# EAGLE schematic RectangularThing-SOICs-TWEAKS-2 (EAGLE 7.7.0)

## Sheet 1 of 7: Power & Modulation Routing
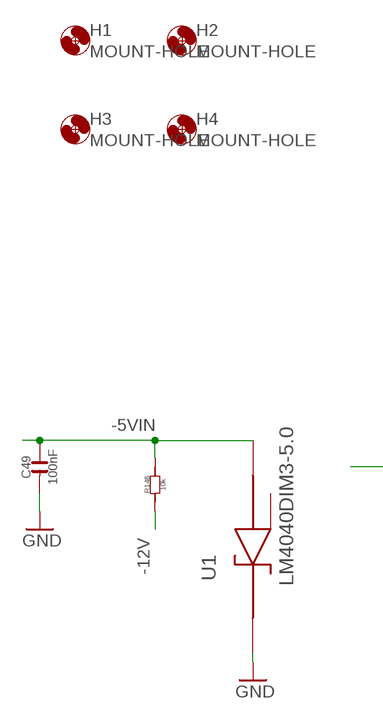
[diagram p0: schematic, sheet 1, part 1 of 2]
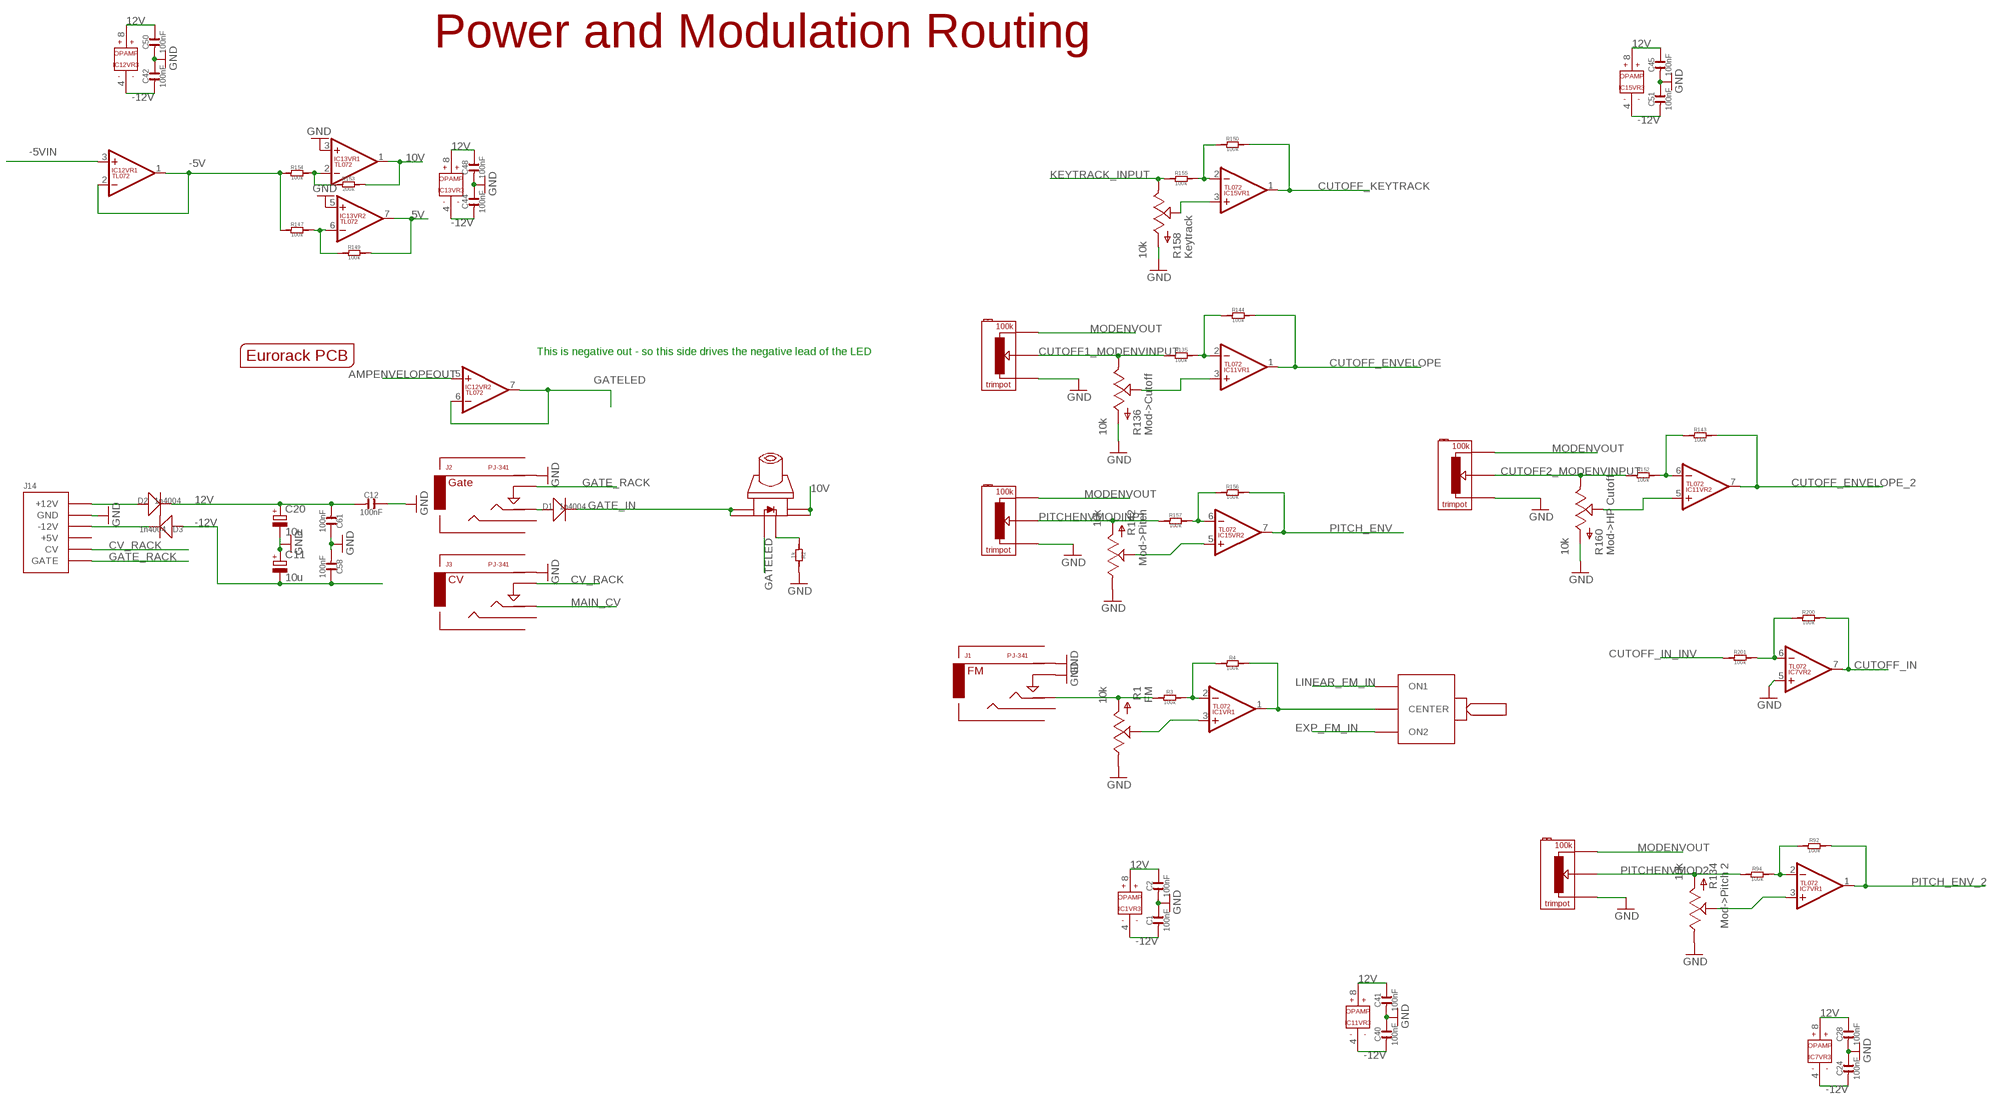
[diagram p1: schematic, sheet 1, part 2 of 2]

### Parts
C1  100nF  C-0603  [C0603]
C2  100nF  C-0603  [C0603]
C11  10u  CAPACITOR_POL-CASE_B  [CASE_B]
C12  100nF  C-0603  [C0603]
C20  10u  CAPACITOR_POL-CASE_B  [CASE_B]
C24  100nF  C-0603  [C0603]
C28  100nF  C-0603  [C0603]
C40  100nF  C-0603  [C0603]
C41  100nF  C-0603  [C0603]
C42  100nF  C-0603  [C0603]
C44  100nF  C-0603  [C0603]
C45  100nF  C-0603  [C0603]
C48  100nF  C-0603  [C0603]
C49  100nF  C-0603  [C0603]
C50  100nF  C-0603  [C0603]
C51  100nF  C-0603  [C0603]
C58  100nF  C-0603  [C0603]
C61  100nF  C-0603  [C0603]
D1  1n4004  D-SMA  [DO-214AC]
D2  1n4004  D-SMA  [DO-214AC]
D3  1n4004  D-SMA  [DO-214AC]
H1  MOUNT-HOLE  [3.2-NOMARKINGS-SMALLSAFEZONE]
H2  MOUNT-HOLE  [3.2-NOMARKINGS-SMALLSAFEZONE]
H3  MOUNT-HOLE  [3.2-NOMARKINGS-SMALLSAFEZONE]
H4  MOUNT-HOLE  [3.2-NOMARKINGS-SMALLSAFEZONE]
IC1  TL072  [SO08]
IC7  TL072  [SO08]
IC11  TL072  [SO08]
IC12  TL072  [SO08]
IC13  TL072  [SO08]
IC15  TL072  [SO08]
J1  PJ-341  AUDIO-JACKINPUT  [3.5MM-JACK-SWITCH-13MM-INPUT]
J2  PJ-341  AUDIO-JACKINPUT  [3.5MM-JACK-SWITCH-13MM-INPUT]
J3  PJ-341  AUDIO-JACKINPUT  [3.5MM-JACK-SWITCH-13MM-INPUT]
J14  POWERSHROUDED  [POWER_16_SHROUDED]
PCB1  EURORACK_PCB36HP_10CM  [EURORACK36HP]
R1  10k  POTZEPHPOT  [OG-POTS_ALPS_POT_VERTICAL]
R2  1k  R-0603  [R0603]
R3  100k  R-0603  [R0603]
R4  100k  R-0603  [R0603]
R92  100k  R-0603  [R0603]
R94  100k  R-0603  [R0603]
R134  10k  POTZEPHPOT  [OG-POTS_ALPS_POT_VERTICAL]
R135  100k  R-0603  [R0603]
R136  10k  POTZEPHPOT  [OG-POTS_ALPS_POT_VERTICAL]
R142  10k  POTZEPHPOT  [OG-POTS_ALPS_POT_VERTICAL]
R143  100k  R-0603  [R0603]
R144  100k  R-0603  [R0603]
R147  100k  R-0603  [R0603]
R148  10k  R-0603  [R0603]
R149  100k  R-0603  [R0603]
R150  100k  R-0603  [R0603]
R152  100k  R-0603  [R0603]
R153  200k  R-0603  [R0603]
R154  100k  R-0603  [R0603]
R155  100k  R-0603  [R0603]
R156  100k  R-0603  [R0603]
R157  100k  R-0603  [R0603]
R158  10k  POTZEPHPOT  [OG-POTS_ALPS_POT_VERTICAL]
R160  10k  POTZEPHPOT  [OG-POTS_ALPS_POT_VERTICAL]
R191  100k  TRIMPOT  [TRIMPOT]
R192  100k  TRIMPOT  [TRIMPOT]
R193  100k  TRIMPOT  [TRIMPOT]
R194  100k  TRIMPOT  [TRIMPOT]
R200  100k  R-0603  [R0603]
R201  100k  R-0603  [R0603]
S1  ONOFFON  [MULTICOMP1MS-ONOFFON]
S2  SWITCH_W_LED_PB6149L-X-102YELLOW  [PB6149L]
U1  LM4040DIM3-5.0  [SOT95P237X112-3N]

### Nets
5V [power]: IC13.7(VR2:OUT) R149.2 ; also sheet 2,5,6
10V [power]: IC13.1(VR1:OUT) R153.2 S2.3 S2.4 ; also sheet 2,6
12V [power]: C2.2 C12.1 C20.+ C28.2 C41.2 C45.2 C48.2 C50.2 C61.1 D2.2(-) IC1.8(VR3:V+) IC7.8(VR3:V+) IC11.8(VR3:V+) IC12.8(VR3:V+) IC13.8(VR3:V+) IC15.8(VR3:V+) ; also sheet 2,4,5,6,7
-5_TO_10V: IC13.2(VR1:-IN) R153.1 R154.2
-5V [power]: IC12.1(VR1:OUT) IC12.2(VR1:-IN) R147.1 R154.1 ; also sheet 2,5,6
-5V_TO_5V: IC13.6(VR2:-IN) R147.2 R149.1
-5VIN [power]: C49.2 IC12.3(VR1:+IN) R148.2 U1.2(ANODE)
-12V [power]: C1.1 C11.- C24.1 C40.1 C42.1 C44.1 C51.1 C58.2 D3.1(+) IC1.4(VR3:V-) IC7.4(VR3:V-) IC11.4(VR3:V-) IC12.4(VR3:V-) IC13.4(VR3:V-) IC15.4(VR3:V-) R148.1 ; also sheet 2,4,5,6,7
AMPENVELOPEOUT: IC12.5(VR2:+IN) ; also sheet 4,5
CUTOFF1_MODENVINPUT: R135.1 R136.P$1(E) R192.P$2
CUTOFF2_MODENVINPUT: R152.1 R160.P$1(E) R194.P$2
CUTOFF_ENVELOPE: IC11.1(VR1:OUT) R144.2 ; also sheet 6
CUTOFF_ENVELOPE_2: IC11.7(VR2:OUT) R143.2 ; also sheet 6
CUTOFF_IN: IC7.7(VR2:OUT) R200.2 ; also sheet 6
CUTOFF_IN_INV: R201.1 ; also sheet 6
CUTOFF_KEYTRACK: IC15.1(VR1:OUT) R150.2 ; also sheet 6
CV_RACK: J3.SWITCH@3(SWITCH) J14.13(CV) J14.14(CV)
EXP_FM_IN: S1.3(ON2) ; also sheet 2
GATE_IN: D1.2(-) S2.1 S2.2 ; also sheet 5
GATE_RACK: J2.SWITCH@3(SWITCH) J14.15(GATE) J14.16(GATE)
GATELED: IC12.6(VR2:-IN) IC12.7(VR2:OUT) S2.LEDPOS(POS)
GND [power]: C1.2 C2.1 C11.+ C12.2 C20.- C24.2 C28.1 C40.2 C41.1 C42.2 C44.2 C45.1 C48.1 C49.1 C50.1 C51.2 C58.1 C61.2 IC7.5(VR2:+IN) IC13.3(VR1:+IN) IC13.5(VR2:+IN) J1.RING@3(RING) J1.SWITCH@3(SWITCH) J2.RING@3(RING) J3.RING@3(RING) J14.3(GND) J14.4(GND) J14.5(GND) J14.6(GND) J14.7(GND) J14.8(GND) R1.P$1(E) R2.2 R134.P$1(E) R136.P$3(A) R142.P$1(E) R158.P$3(A) R160.P$3(A) R191.P$1 R192.P$1 R193.P$1 R194.P$1 U1.1(CATHODE) ; also sheet 2,3,4,5,6,7
KEYTRACK_INPUT: R155.1 R158.P$1(E) ; also sheet 2
LINEAR_FM_IN: S1.1(ON1) ; also sheet 2
MAIN_CV: J3.TIP@3(TIP) ; also sheet 2
MODENVOUT: R191.P$3 R192.P$3 R193.P$3 R194.P$3 ; also sheet 5
N$7 [power]: D2.1(+) J14.9(+12V) J14.10(+12V)
N$8 [power]: D3.2(-) J14.1(-12V) J14.2(-12V)
N$22: R2.1 S2.LEDNEG(NEG)
N$41: IC1.1(VR1:OUT) R4.2 S1.2(CENTER)
N$66: IC1.2(VR1:-IN) R3.2 R4.1
N$67: IC15.2(VR1:-IN) R150.1 R155.2
N$68: IC15.3(VR1:+IN) R158.P$2(S)
N$69: IC11.2(VR1:-IN) R135.2 R144.1
N$72: IC15.6(VR2:-IN) R156.1 R157.2
N$73: IC11.3(VR1:+IN) R136.P$2(S)
N$75: IC7.2(VR1:-IN) R92.1 R94.2
N$76: IC7.3(VR1:+IN) R134.P$2(S)
N$78: IC15.5(VR2:+IN) R142.P$2(S)
N$81: IC1.3(VR1:+IN) R1.P$2(S)
N$82: J1.TIP@3(TIP) R1.P$3(A) R3.1
N$86: D1.1(+) J2.TIP@3(TIP)
N$126: IC11.6(VR2:-IN) R143.1 R152.2
N$127: IC11.5(VR2:+IN) R160.P$2(S)
N$148: IC7.6(VR2:-IN) R200.1 R201.2
PITCH_ENV: IC15.7(VR2:OUT) R156.2 ; also sheet 2
PITCH_ENV_2: IC7.1(VR1:OUT) R92.2 ; also sheet 2
PITCHENVMOD2: R94.1 R134.P$3(A) R191.P$2
PITCHENVMODINP1: R142.P$3(A) R157.1 R193.P$2
Unconnected: J1.SECOND@3(SECOND) J2.SECOND@3(SECOND) J3.SECOND@3(SECOND) J14.11(+5V) J14.12(+5V) U1.3(NC)

### Notes on the sheet
- Power and Modulation Routing
- This is negative out - so this side drives the negative lead of the LED

## Sheet 2 of 7: Oscillator
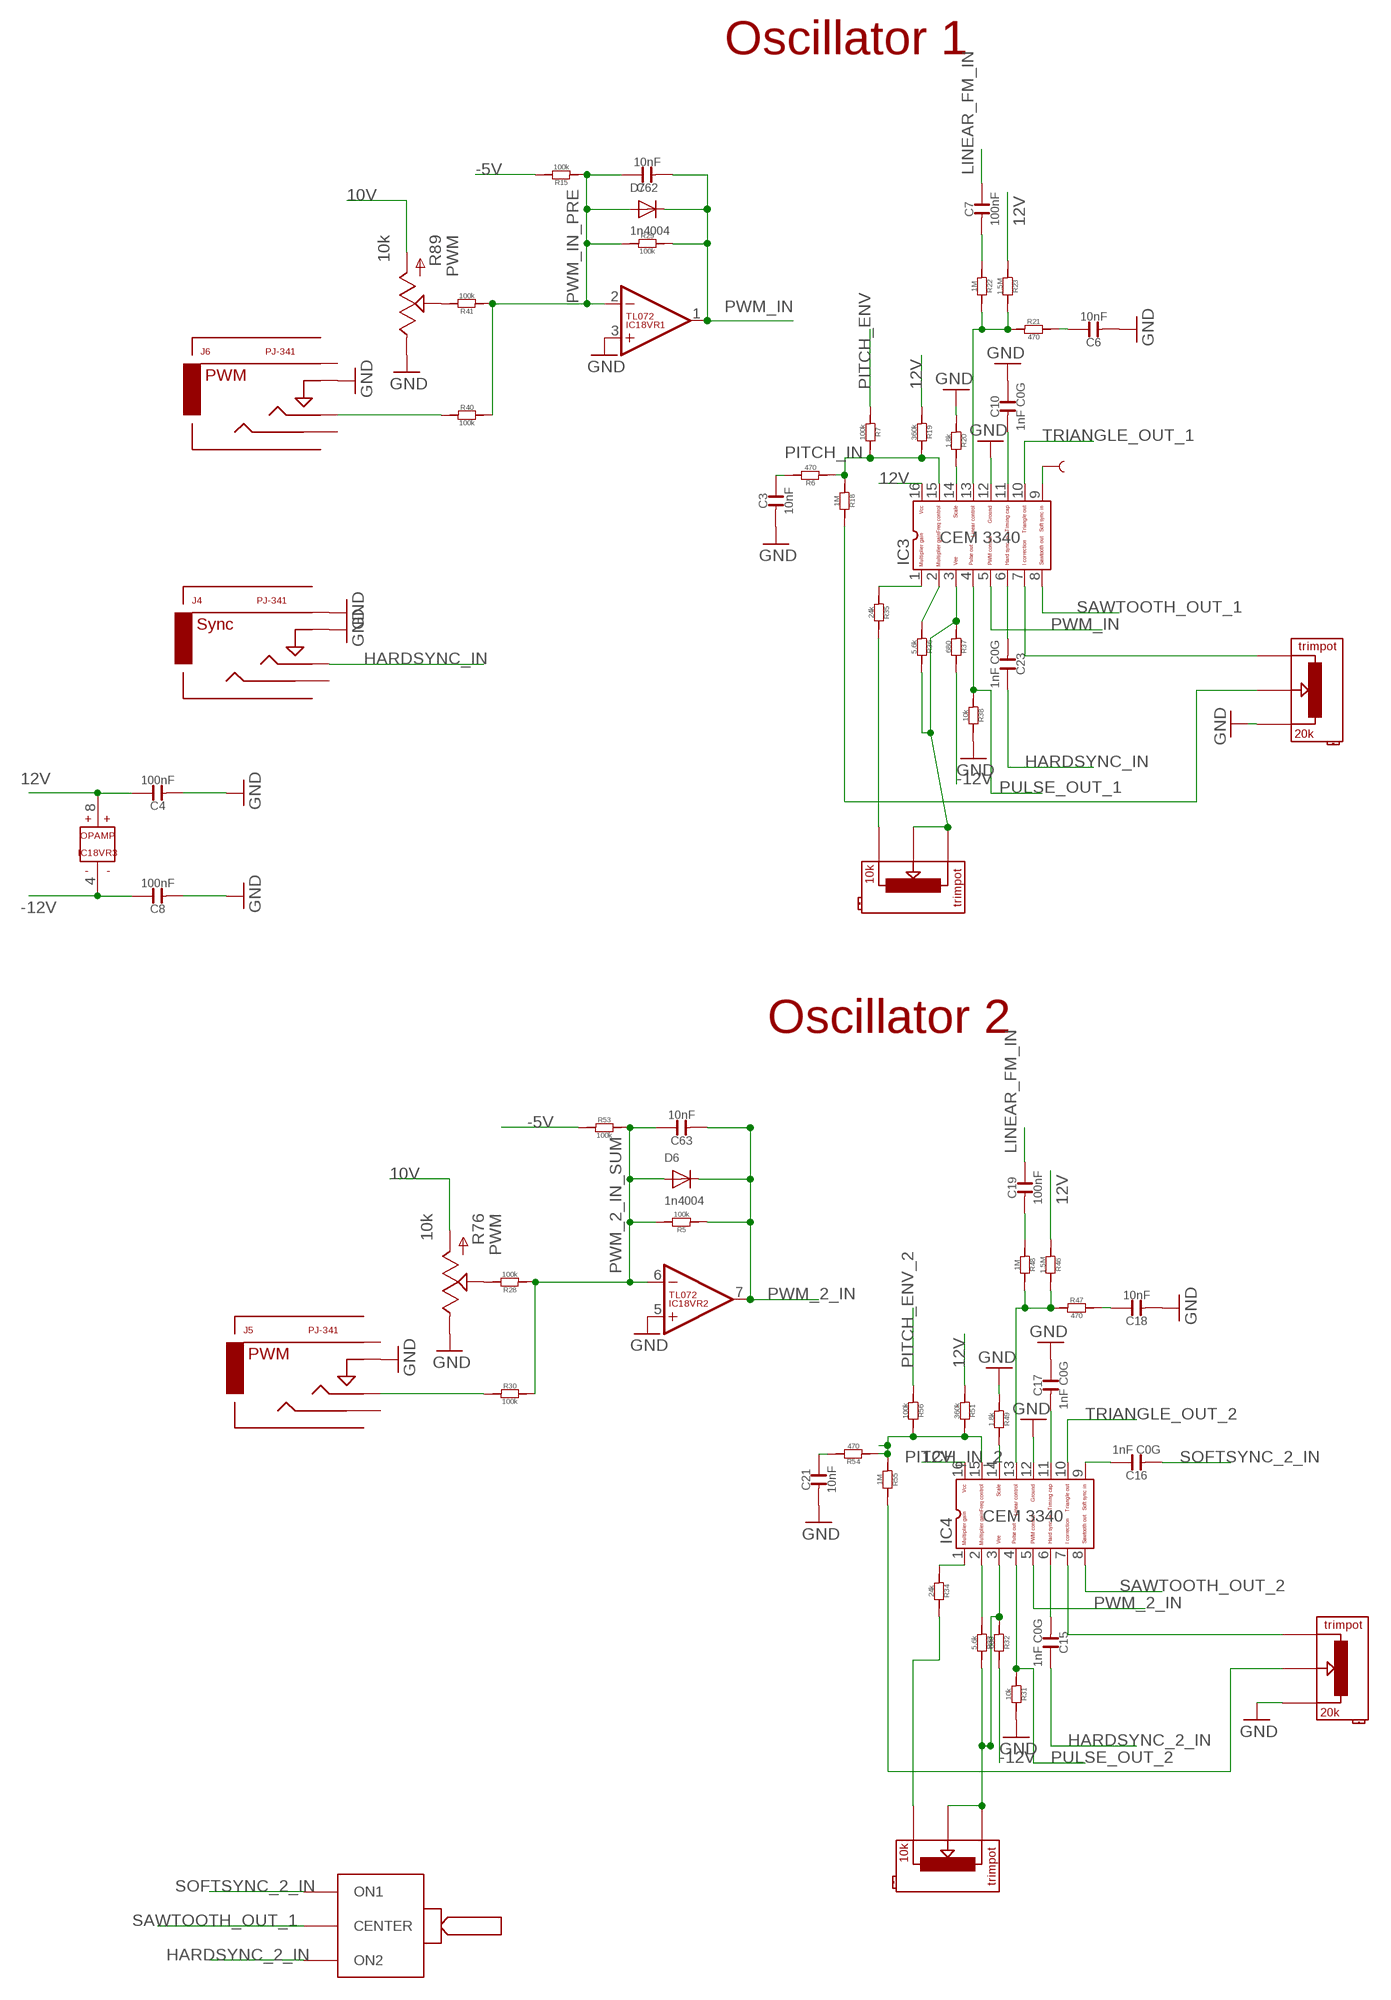
[diagram p2: schematic, sheet 2, part 1 of 2]
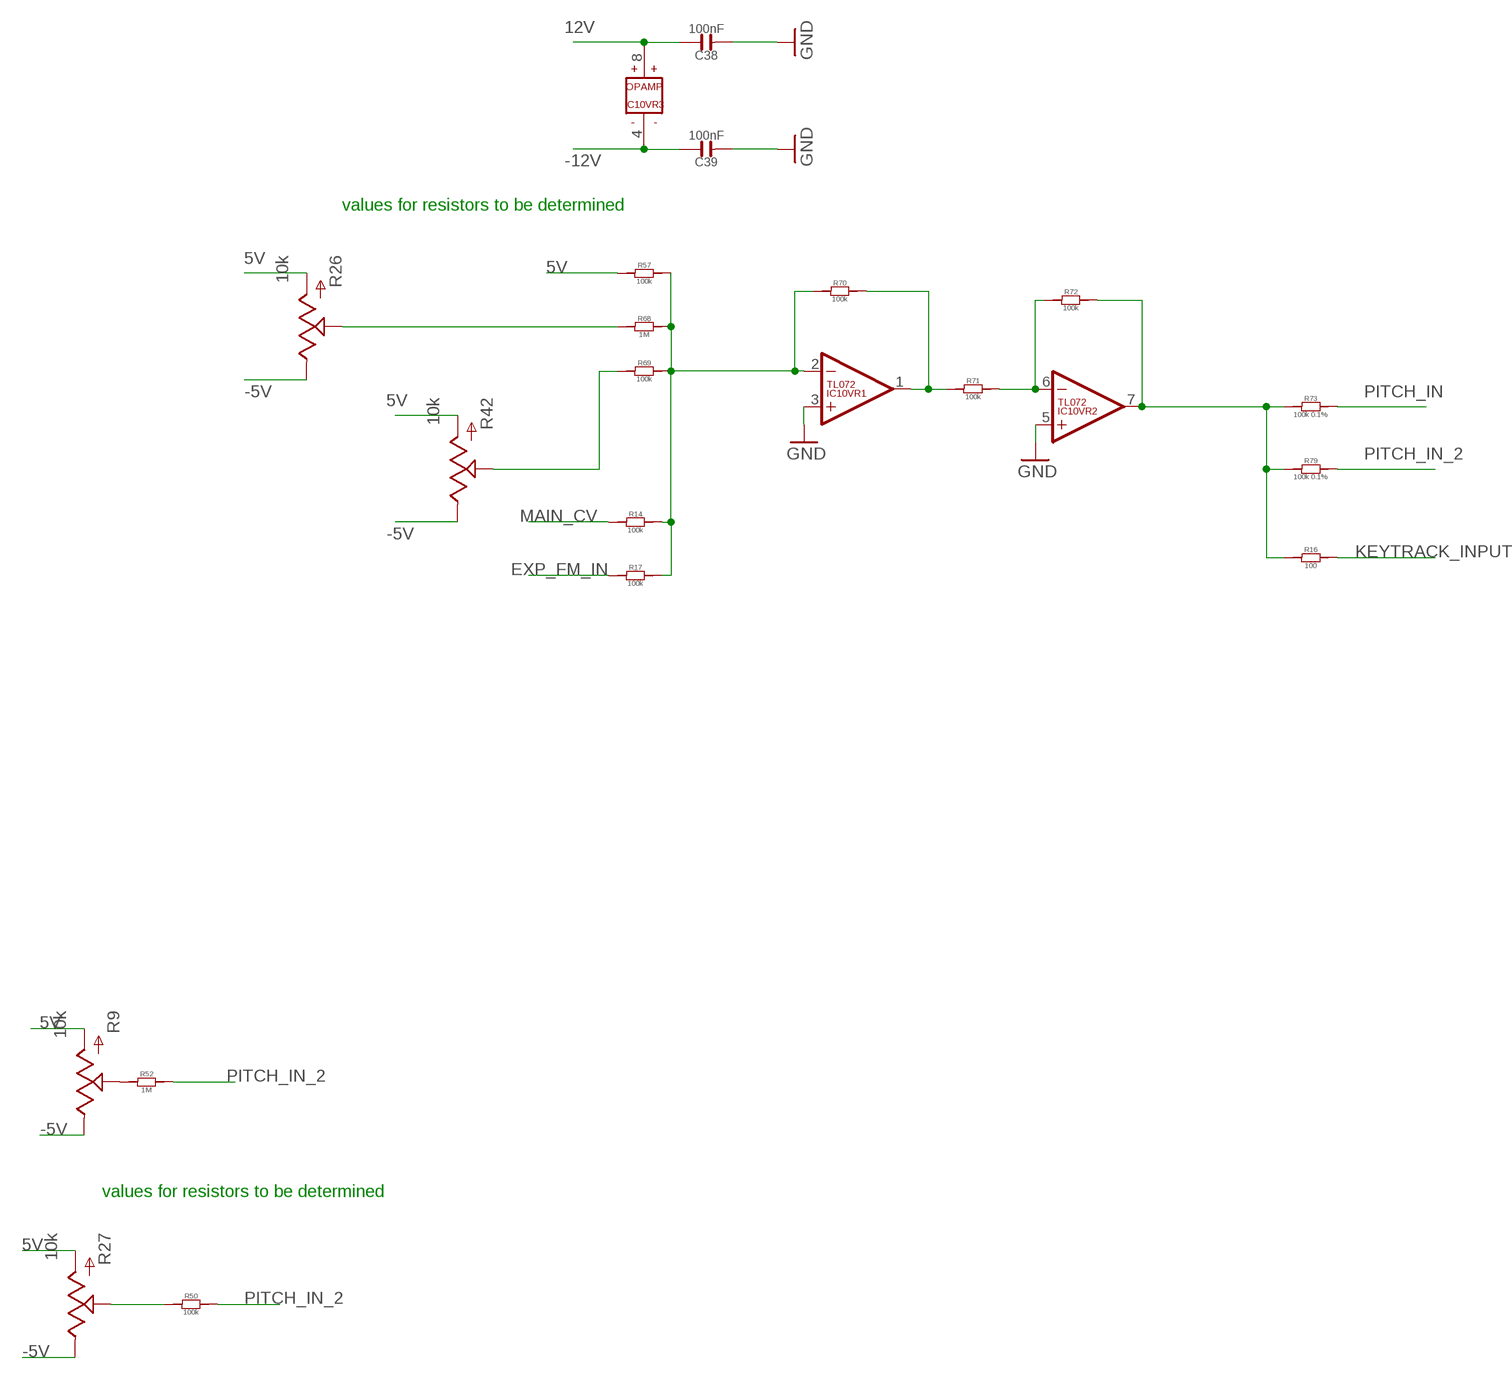
[diagram p3: schematic, sheet 2, part 2 of 2]

### Parts
C3  10nF  C-0603  [C0603]
C4  100nF  C-0603  [C0603]
C6  10nF  C-0603  [C0603]
C7  100nF  C-0603  [C0603]
C8  100nF  C-0603  [C0603]
C10  1nF C0G  C-0603  [C0603]
C15  1nF C0G  C-0603  [C0603]
C16  1nF C0G  C-0603  [C0603]
C17  1nF C0G  C-0603  [C0603]
C18  10nF  C-0603  [C0603]
C19  100nF  C-0603  [C0603]
C21  10nF  C-0603  [C0603]
C23  1nF C0G  C-0603  [C0603]
C38  100nF  C-0603  [C0603]
C39  100nF  C-0603  [C0603]
C62  10nF  C-0603  [C0603]
C63  10nF  C-0603  [C0603]
D6  1n4004  DIODESOD-323F  [SOD-323F]
D7  1n4004  DIODESOD-323F  [SOD-323F]
IC3  CEM3340SOIC16  [SO16]
IC4  CEM3340SOIC16  [SO16]
IC10  TL072  [SO08]
IC18  TL072  [SO08]
J4  PJ-341  AUDIO-JACKINPUT  [3.5MM-JACK-SWITCH-13MM-INPUT]
J5  PJ-341  AUDIO-JACKINPUT  [3.5MM-JACK-SWITCH-13MM-INPUT]
J6  PJ-341  AUDIO-JACKINPUT  [3.5MM-JACK-SWITCH-13MM-INPUT]
R5  100k  R-0603  [R0603]
R6  470  R-0603  [R0603]
R7  100k  R-0603  [R0603]
R9  10k  POTZEPHPOT_BIGKNOB  [OG-POTS_ALPS_POT_VERTICAL_WITHBIGKNOB]
R14  100k  R-0603  [R0603]
R15  100k  R-0603  [R0603]
R16  100  R-0603  [R0603]
R17  100k  R-0603  [R0603]
R18  1M  R-0603  [R0603]
R19  360k  R-0603  [R0603]
R20  1.8k  R-0603  [R0603]
R21  470  R-0603  [R0603]
R22  1M  R-0603  [R0603]
R23  1.5M  R-0603  [R0603]
R26  10k  POTZEPHPOT_BIGKNOB  [OG-POTS_ALPS_POT_VERTICAL_WITHBIGKNOB]
R27  10k  POTZEPHPOT_BIGKNOB  [OG-POTS_ALPS_POT_VERTICAL_WITHBIGKNOB]
R28  100k  R-0603  [R0603]
R29  100k  R-0603  [R0603]
R30  100k  R-0603  [R0603]
R31  10k  R-0603  [R0603]
R32  680  R-0603  [R0603]
R33  5.6k  R-0603  [R0603]
R34  24k  R-0603  [R0603]
R35  24k  R-0603  [R0603]
R36  5.6k  R-0603  [R0603]
R37  680  R-0603  [R0603]
R38  10k  R-0603  [R0603]
R40  100k  R-0603  [R0603]
R41  100k  R-0603  [R0603]
R42  10k  POTZEPHPOT_BIGKNOB  [OG-POTS_ALPS_POT_VERTICAL_WITHBIGKNOB]
R46  1.5M  R-0603  [R0603]
R47  470  R-0603  [R0603]
R48  1M  R-0603  [R0603]
R49  1.8k  R-0603  [R0603]
R50  100k  R-0603  [R0603]
R51  360k  R-0603  [R0603]
R52  1M  R-0603  [R0603]
R53  100k  R-0603  [R0603]
R54  470  R-0603  [R0603]
R55  1M  R-0603  [R0603]
R56  100k  R-0603  [R0603]
R57  100k  R-0603  [R0603]
R68  1M  R-0603  [R0603]
R69  100k  R-0603  [R0603]
R70  100k  R-0603  [R0603]
R71  100k  R-0603  [R0603]
R72  100k  R-0603  [R0603]
R73  100k 0.1%  R-0603  [R0603]
R76  10k  POTZEPHPOT  [OG-POTS_ALPS_POT_VERTICAL]
R79  100k 0.1%  R-0603  [R0603]
R89  10k  POTZEPHPOT  [OG-POTS_ALPS_POT_VERTICAL]
R187  10k  TRIMPOT  [TRIMPOT]
R188  20k  TRIMPOT  [TRIMPOT]
R189  20k  TRIMPOT  [TRIMPOT]
R190  10k  TRIMPOT  [TRIMPOT]
S3  ONOFFON  [MULTICOMP1MS-ONOFFON]
TP3  TEST-POINT3X5  [PAD.03X.05]

### Nets
5V [power]: R9.P$3(A) R26.P$3(A) R27.P$3(A) R42.P$3(A) R57.1 ; also sheet 1,5,6
10V [power]: R76.P$3(A) R89.P$3(A) ; also sheet 1,6
12V [power]: C4.2 C38.2 IC3.16 IC4.16 IC10.8(VR3:V+) IC18.8(VR3:V+) R19.1 R23.1 R46.1 R51.1 ; also sheet 1,4,5,6,7
-5V [power]: R9.P$1(E) R15.2 R26.P$1(E) R27.P$1(E) R42.P$1(E) R53.1 ; also sheet 1,5,6
-12V [power]: C8.2 C39.2 IC10.4(VR3:V-) IC18.4(VR3:V-) R32.2 R37.2 ; also sheet 1,4,5,6,7
EXP_FM_IN: R17.1 ; also sheet 1
GND [power]: C3.1 C4.1 C6.1 C8.1 C10.2 C17.2 C18.1 C21.1 C38.1 C39.1 IC3.12 IC4.12 IC10.3(VR1:+IN) IC10.5(VR2:+IN) IC18.3(VR1:+IN) IC18.5(VR2:+IN) J4.RING@3(RING) J4.SWITCH@3(SWITCH) J5.SWITCH@3(SWITCH) J6.SWITCH@3(SWITCH) R20.1 R31.2 R38.2 R49.1 R76.P$1(E) R89.P$1(E) R188.P$3 R189.P$3 ; also sheet 1,3,4,5,6,7
HARDSYNC_2_IN: C15.2 S3.3(ON2)
HARDSYNC_IN: C23.2 J4.TIP@3(TIP)
INVERTED_CVSUM: IC10.1(VR1:OUT) R70.2 R71.1
KEYTRACK_INPUT: R16.2 ; also sheet 1
LINEAR_FM_IN: C7.2 C19.2 ; also sheet 1
MAIN_CV: R14.1 ; also sheet 1
MAIN_CV_SUMLINE: IC10.2(VR1:-IN) R14.2 R17.2 R57.2 R68.2 R69.2 R70.1
MASTER_COARSEPITCH: R42.P$2(S) R69.1
MASTER_FINEPITCH: R26.P$2(S) R68.1
N$16: C3.2 R6.2
N$31: C6.2 R21.2
N$34: IC3.13 R21.1 R22.2 R23.2
N$35: C7.1 R22.1
N$36: C10.1 IC3.11
N$37: IC3.9 TP3.P$1
N$38: IC3.14 R20.2
N$42: C23.1 IC3.6
N$43: IC3.1 R35.1
N$44: R35.2 R190.P$3
N$45: IC3.3 R36.2 R37.1 R190.P$1 R190.P$2
N$46: R18.2 R188.P$2
N$47: IC3.2 R36.1
N$48: IC3.7 R188.P$1
N$71: C21.2 R54.2
N$77: C18.2 R47.2
N$83: R41.2 R89.P$2(S)
N$85: J6.TIP@3(TIP) R40.1
N$87: IC4.13 R46.2 R47.1 R48.2
N$88: C19.1 R48.1
N$89: C17.1 IC4.11
N$90: C16.2 IC4.9
N$92: IC4.14 R49.2
N$94: C15.1 IC4.6
N$95: IC4.1 R34.1
N$96: R34.2 R187.P$3
N$97: IC4.3 R32.1 R33.2 R187.P$1 R187.P$2
N$98: IC4.2 R33.1
N$99: R55.2 R189.P$2
N$100: IC4.7 R189.P$1
N$101: R28.2 R76.P$2(S)
N$103: J5.TIP@3(TIP) R30.1
N$104: R27.P$2(S) R50.1
N$105: R9.P$2(S) R52.1
PITCH_ENV: R7.1 ; also sheet 1
PITCH_ENV_2: R56.1 ; also sheet 1
PITCH_IN: IC3.15 R6.1 R7.2 R18.1 R19.2 R73.2
PITCH_IN_2: IC4.15 R50.2 R51.2 R52.2 R54.1 R55.1 R56.2 R79.2
POSTINVERTED_CVSUM: IC10.6(VR2:-IN) R71.2 R72.1
PRESUMMED_PITCH: IC10.7(VR2:OUT) R16.1 R72.2 R73.1 R79.1
PULSE_OUT_1: IC3.4 R38.1 ; also sheet 3
PULSE_OUT_2: IC4.4 R31.1 ; also sheet 3,7
PWM_2_IN: C63.1 D6.C IC4.5 IC18.7(VR2:OUT) R5.1
PWM_2_IN_SUM: C63.2 D6.A IC18.6(VR2:-IN) R5.2 R28.1 R30.2 R53.2
PWM_IN: C62.1 D7.C IC3.5 IC18.1(VR1:OUT) R29.2
PWM_IN_PRE: C62.2 D7.A IC18.2(VR1:-IN) R15.1 R29.1 R40.2 R41.1
SAWTOOTH_OUT_1: IC3.8 S3.2(CENTER) ; also sheet 3,7
SAWTOOTH_OUT_2: IC4.8 ; also sheet 3,7
SOFTSYNC_2_IN: C16.1 S3.1(ON1)
TRIANGLE_OUT_1: IC3.10 ; also sheet 3
TRIANGLE_OUT_2: IC4.10 ; also sheet 3
Unconnected: J4.SECOND@3(SECOND) J5.RING@3(RING) J5.SECOND@3(SECOND) J6.RING@3(RING) J6.SECOND@3(SECOND)

### Notes on the sheet
- Oscillator 1
- values for resistors to be determined
- Oscillator 2
- values for resistors to be determined

## Sheet 3 of 7: Mixer
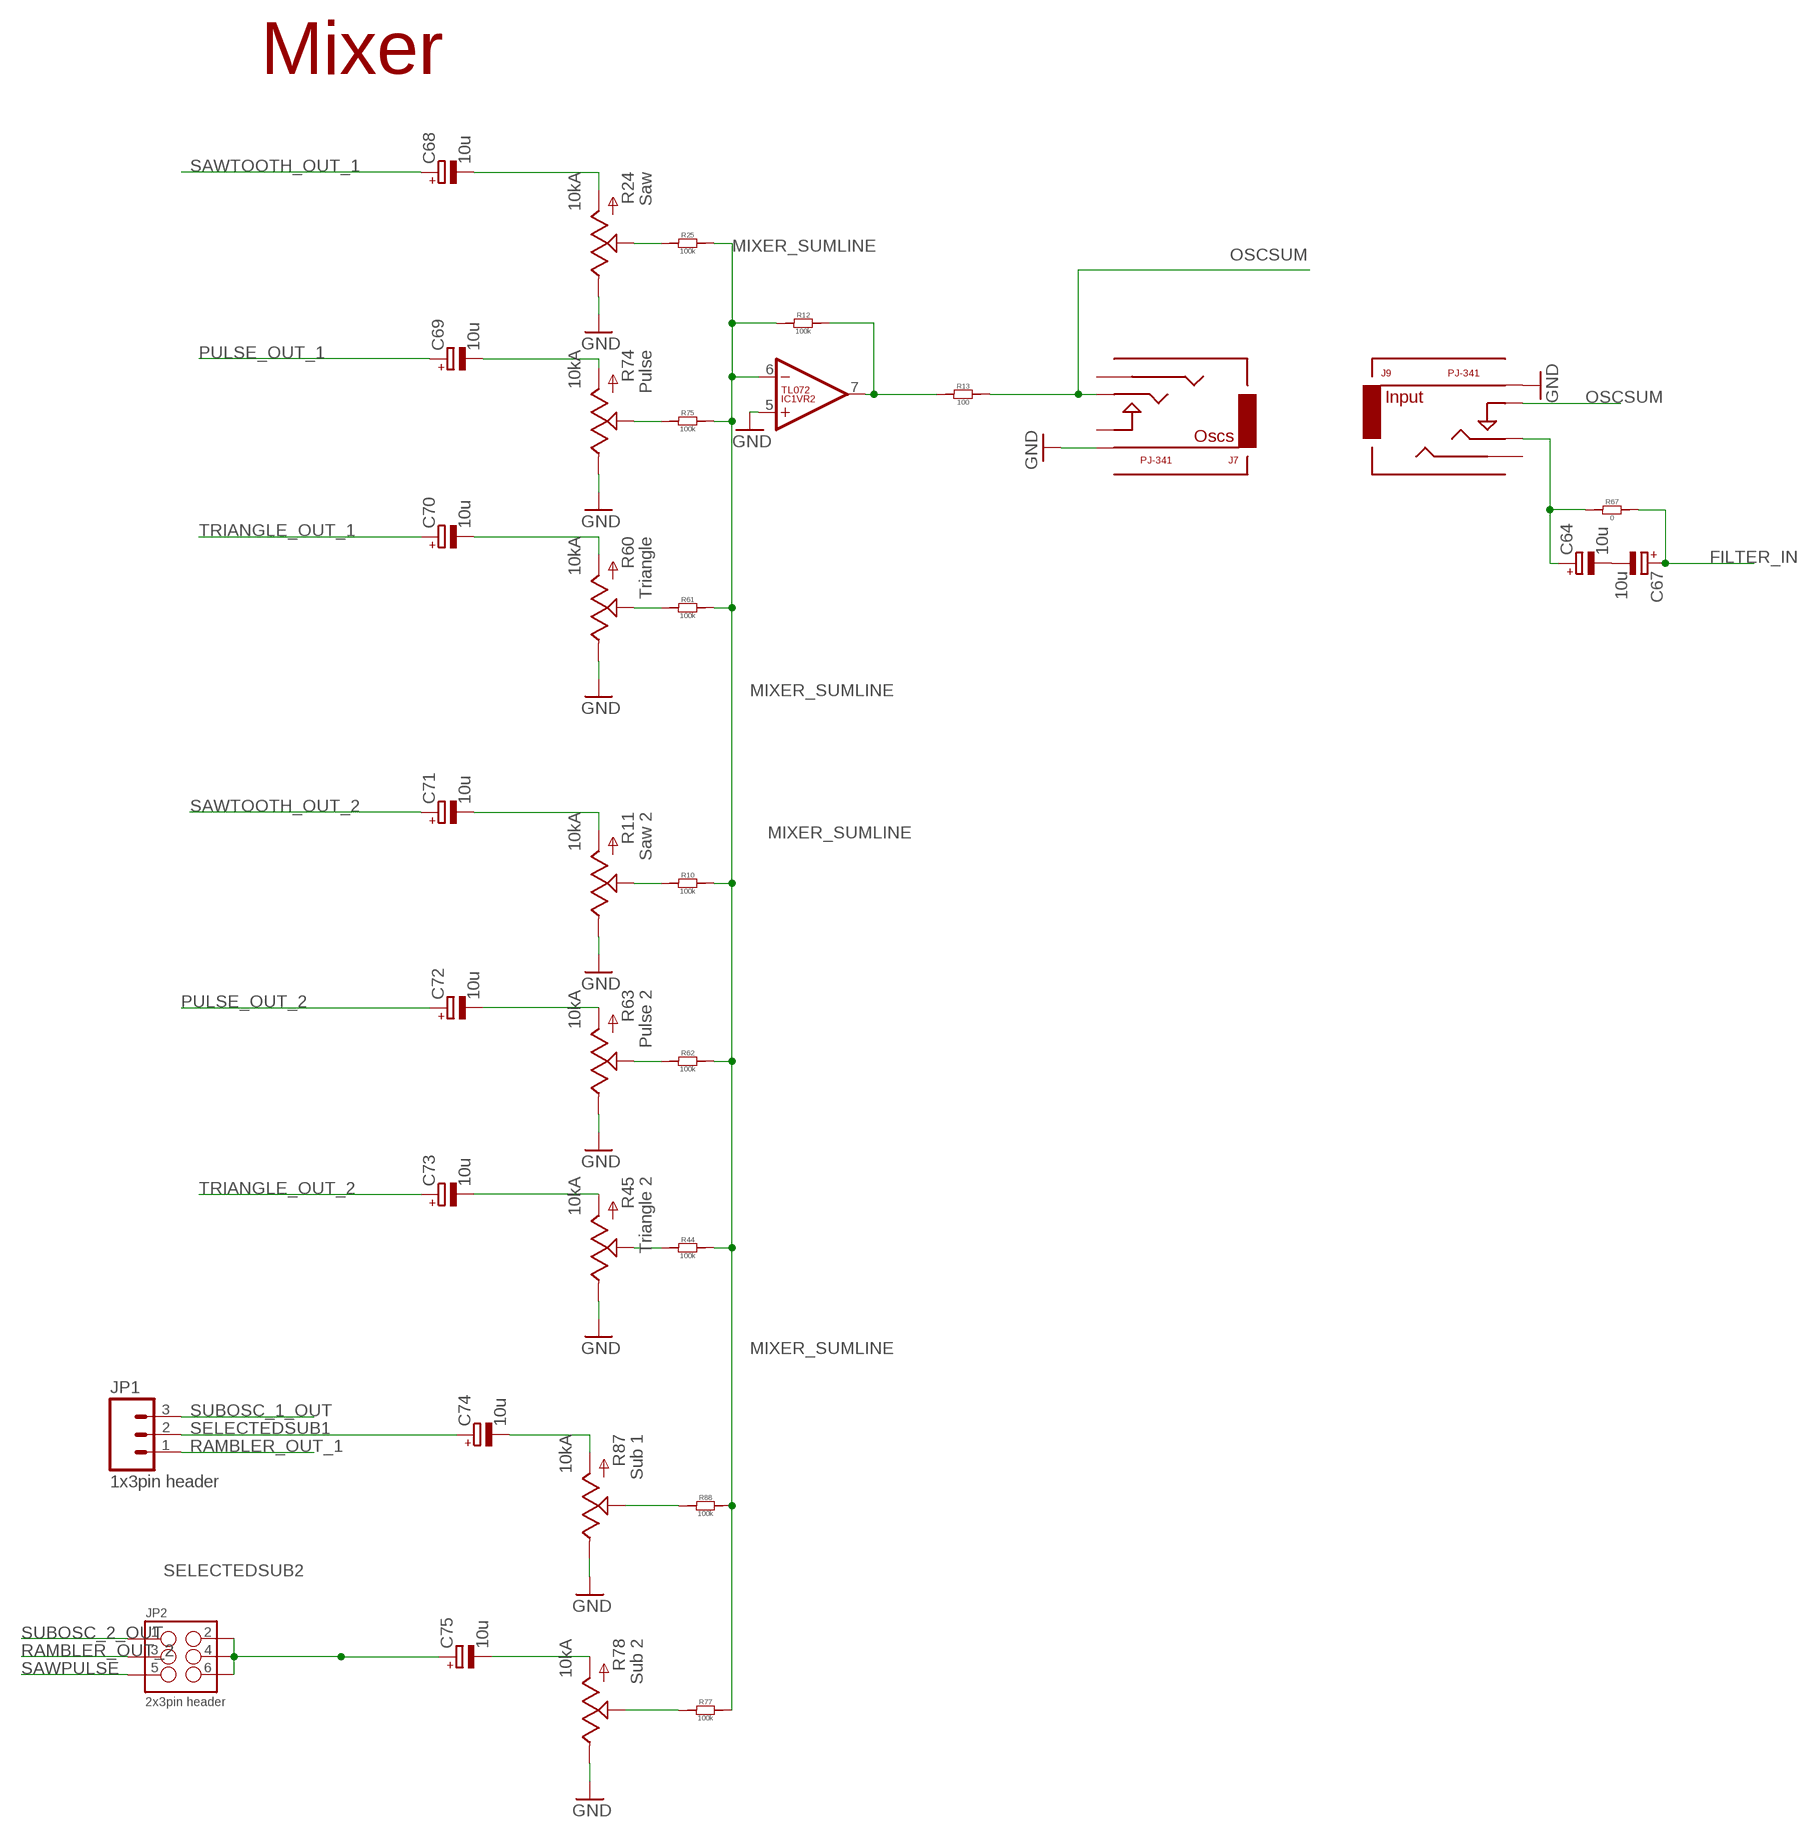
[diagram p4: schematic, sheet 3]

### Parts
C64  10u  CAPACITOR_POL-CASE_B  [CASE_B]
C67  10u  CAPACITOR_POL-CASE_B  [CASE_B]
C68  10u  CAPACITOR_POL-CASE_B  [CASE_B]
C69  10u  CAPACITOR_POL-CASE_B  [CASE_B]
C70  10u  CAPACITOR_POL-CASE_B  [CASE_B]
C71  10u  CAPACITOR_POL-CASE_B  [CASE_B]
C72  10u  CAPACITOR_POL-CASE_B  [CASE_B]
C73  10u  CAPACITOR_POL-CASE_B  [CASE_B]
C74  10u  CAPACITOR_POL-CASE_B  [CASE_B]
C75  10u  CAPACITOR_POL-CASE_B  [CASE_B]
J7  PJ-341  AUDIO-JACKOUTPUT  [3.5MM-JACK-SWITCH-13MM-OUTPUT]
J9  PJ-341  AUDIO-JACKINPUT  [3.5MM-JACK-SWITCH-13MM-INPUT]
JP1  1x3pin header  M031X03_NO_SILK  [1X03_NO_SILK]
JP2  2x3pin header  M03X2NO_SILK  [2X3-NS]
R10  100k  R-0603  [R0603]
R11  10kA  POTZEPHPOT  [OG-POTS_ALPS_POT_VERTICAL]
R12  100k  R-0603  [R0603]
R13  100  R-0603  [R0603]
R24  10kA  POTZEPHPOT  [OG-POTS_ALPS_POT_VERTICAL]
R25  100k  R-0603  [R0603]
R44  100k  R-0603  [R0603]
R45  10kA  POTZEPHPOT  [OG-POTS_ALPS_POT_VERTICAL]
R60  10kA  POTZEPHPOT  [OG-POTS_ALPS_POT_VERTICAL]
R61  100k  R-0603  [R0603]
R62  100k  R-0603  [R0603]
R63  10kA  POTZEPHPOT  [OG-POTS_ALPS_POT_VERTICAL]
R67  0  R-0603  [R0603]
R74  10kA  POTZEPHPOT  [OG-POTS_ALPS_POT_VERTICAL]
R75  100k  R-0603  [R0603]
R77  100k  R-0603  [R0603]
R78  10kA  POTZEPHPOT  [OG-POTS_ALPS_POT_VERTICAL]
R87  10kA  POTZEPHPOT  [OG-POTS_ALPS_POT_VERTICAL]
R88  100k  R-0603  [R0603]

### Nets
FILTER_IN: C67.+ R67.2 ; also sheet 4,6
GND [power]: IC1.5(VR2:+IN) J7.RING@3(RING) J9.RING@3(RING) R11.P$1(E) R24.P$1(E) R45.P$1(E) R60.P$1(E) R63.P$1(E) R74.P$1(E) R78.P$1(E) R87.P$1(E) ; also sheet 1,2,4,5,6,7
MIXER_POSTSUM: IC1.7(VR2:OUT) R12.2 R13.1
MIXER_SUMLINE: IC1.6(VR2:-IN) R10.2 R12.1 R25.2 R44.2 R61.2 R62.2 R75.2 R77.2 R88.2
N$40: R87.P$2(S) R88.1
N$49: R60.P$2(S) R61.1
N$50: R74.P$2(S) R75.1
N$51: R24.P$2(S) R25.1
N$52: C68.- R24.P$3(A)
N$53: C69.- R74.P$3(A)
N$57: C70.- R60.P$3(A)
N$84: C64.- C67.-
N$109: C71.- R11.P$3(A)
N$110: C72.- R63.P$3(A)
N$114: C73.- R45.P$3(A)
N$115: R44.1 R45.P$2(S)
N$116: R62.1 R63.P$2(S)
N$117: R10.1 R11.P$2(S)
N$118: R77.1 R78.P$2(S)
N$119: C74.- R87.P$3(A)
N$122: C75.- R78.P$3(A)
OSCSUM: J7.TIP@3(TIP) J9.SWITCH@3(SWITCH) R13.2
PREBLOCK_FILTER_IN: C64.+ J9.TIP@3(TIP) R67.1
PULSE_OUT_1: C69.+ ; also sheet 2
PULSE_OUT_2: C72.+ ; also sheet 2,7
RAMBLER_OUT_1: JP1.1 ; also sheet 7
RAMBLER_OUT_2: JP2.3 ; also sheet 7
SAWPULSE: JP2.5 ; also sheet 7
SAWTOOTH_OUT_1: C68.+ ; also sheet 2,7
SAWTOOTH_OUT_2: C71.+ ; also sheet 2,7
SELECTEDSUB1: C74.+ JP1.2
SELECTEDSUB2: C75.+ JP2.2 JP2.4 JP2.6
SUBOSC_1_OUT: JP1.3 ; also sheet 7
SUBOSC_2_OUT: JP2.1 ; also sheet 7
TRIANGLE_OUT_1: C70.+ ; also sheet 2
TRIANGLE_OUT_2: C73.+ ; also sheet 2
Unconnected: J7.SECOND@3(SECOND) J7.SWITCH@3(SWITCH) J9.SECOND@3(SECOND)

### Notes on the sheet
- Mixer

## Sheet 4 of 7: VCA
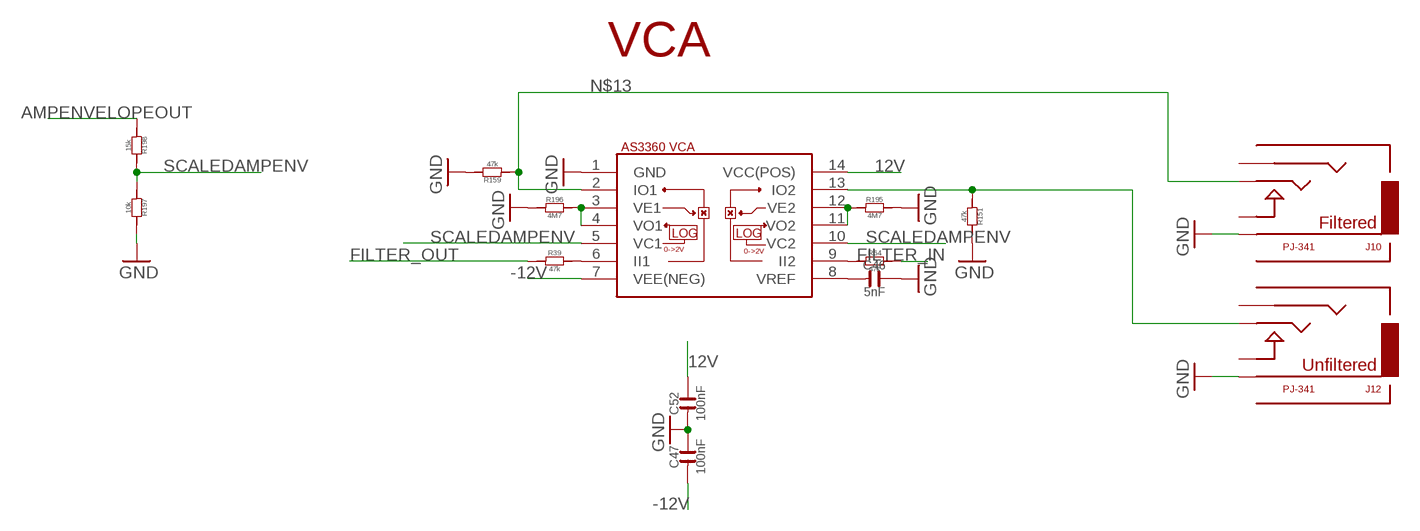
[diagram p5: schematic, sheet 4]

### Parts
C46  5nF  C-0603  [C0603]
C47  100nF  C-0603  [C0603]
C52  100nF  C-0603  [C0603]
IC14  CEM3360SOIC14  [SO14]
J10  PJ-341  AUDIO-JACKOUTPUT  [3.5MM-JACK-SWITCH-13MM-OUTPUT]
J12  PJ-341  AUDIO-JACKOUTPUT  [3.5MM-JACK-SWITCH-13MM-OUTPUT]
R39  47k  R-0603  [R0603]
R64  47k  R-0603  [R0603]
R151  47k  R-0603  [R0603]
R159  47k  R-0603  [R0603]
R195  4M7  R-0603  [R0603]
R196  4M7  R-0603  [R0603]
R197  10k  R-0603  [R0603]
R198  15k  R-0603  [R0603]

### Nets
12V [power]: C52.2 IC14.14(VCC(POS)) ; also sheet 1,2,5,6,7
-12V [power]: C47.1 IC14.7(VEE(NEG)) ; also sheet 1,2,5,6,7
AMPENVELOPEOUT: R198.1 ; also sheet 1,5
FILTER_IN: R64.2 ; also sheet 3,6
FILTER_OUT: R39.1 ; also sheet 6
GND [power]: C46.2 C47.2 C52.1 IC14.1(GND) J10.RING@3(RING) J12.RING@3(RING) R151.2 R159.2 R195.2 R196.1 R197.2 ; also sheet 1,2,3,5,6,7
N$5: C46.1 IC14.8(VREF)
N$12: IC14.3(VE1) IC14.4(VO1) R196.2
N$13: IC14.2(IO1) J10.TIP@3(TIP) R159.1
N$14: IC14.13(IO2) J12.TIP@3(TIP) R151.1
N$15: IC14.11(VO2) IC14.12(VE2) R195.1
N$54: IC14.9(II2) R64.1
N$55: IC14.6(II1) R39.2
SCALEDAMPENV: IC14.5(VC1) IC14.10(VC2) R197.1 R198.2
Unconnected: J10.SECOND@3(SECOND) J10.SWITCH@3(SWITCH) J12.SECOND@3(SECOND) J12.SWITCH@3(SWITCH)

### Notes on the sheet
- VCA

## Sheet 5 of 7: Envelopes
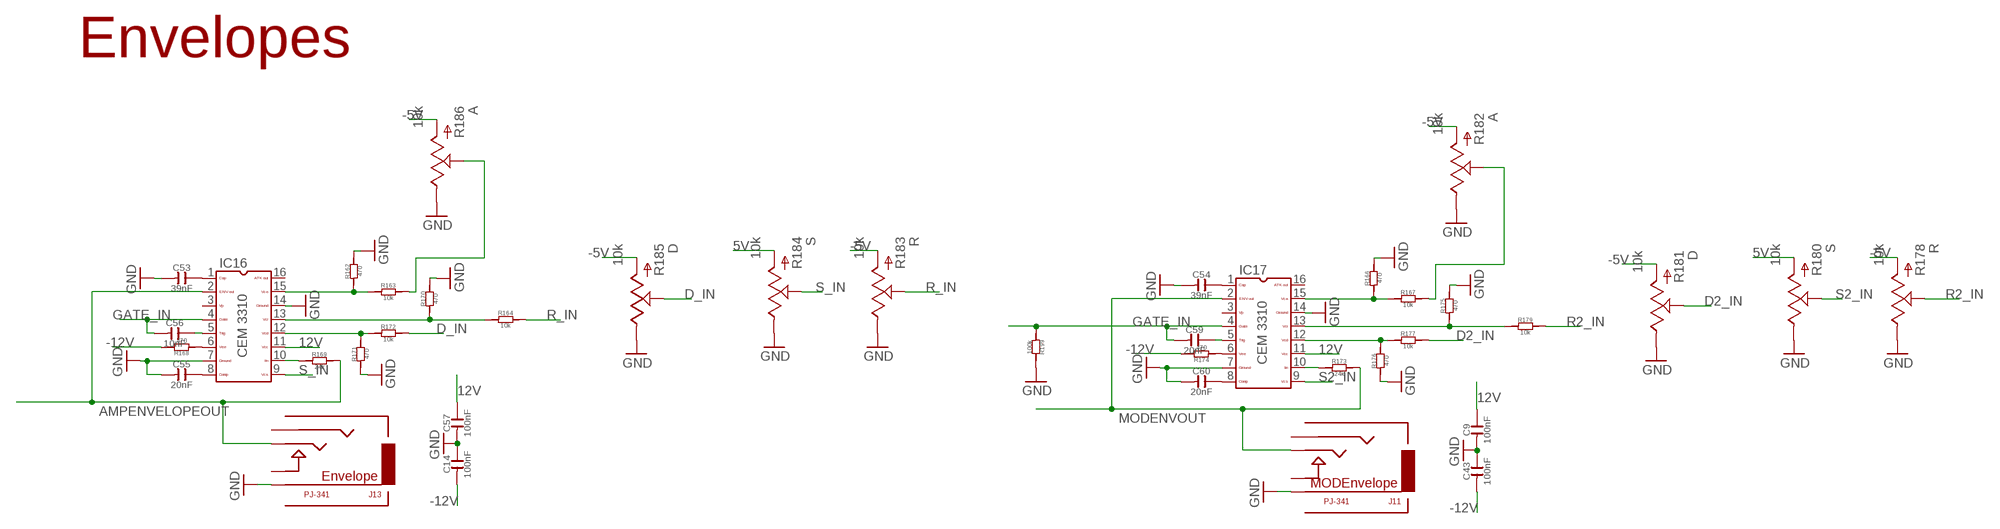
[diagram p6: schematic, sheet 5]

### Parts
C9  100nF  C-0603  [C0603]
C14  100nF  C-0603  [C0603]
C43  100nF  C-0603  [C0603]
C53  39nF  C-0603  [C0603]
C54  39nF  C-0603  [C0603]
C55  20nF  C-0603  [C0603]
C56  10nF  C-0603  [C0603]
C57  100nF  C-0603  [C0603]
C59  20nF  C-0603  [C0603]
C60  20nF  C-0603  [C0603]
IC16  CEM3310SOIC16  [SO16]
IC17  CEM3310SOIC16  [SO16]
J11  PJ-341  AUDIO-JACKOUTPUT  [3.5MM-JACK-SWITCH-13MM-OUTPUT]
J13  PJ-341  AUDIO-JACKOUTPUT  [3.5MM-JACK-SWITCH-13MM-OUTPUT]
R162  470  R-0603  [R0603]
R163  10k  R-0603  [R0603]
R164  10k  R-0603  [R0603]
R166  470  R-0603  [R0603]
R167  10k  R-0603  [R0603]
R168  470  R-0603  [R0603]
R169  24k  R-0603  [R0603]
R170  470  R-0603  [R0603]
R171  470  R-0603  [R0603]
R172  10k  R-0603  [R0603]
R173  24k  R-0603  [R0603]
R174  470  R-0603  [R0603]
R175  470  R-0603  [R0603]
R176  470  R-0603  [R0603]
R177  10k  R-0603  [R0603]
R178  10k  POTZEPHPOT  [OG-POTS_ALPS_POT_VERTICAL]
R179  10k  R-0603  [R0603]
R180  10k  POTZEPHPOT  [OG-POTS_ALPS_POT_VERTICAL]
R181  10k  POTZEPHPOT  [OG-POTS_ALPS_POT_VERTICAL]
R182  10k  POTZEPHPOT  [OG-POTS_ALPS_POT_VERTICAL]
R183  10k  POTZEPHPOT  [OG-POTS_ALPS_POT_VERTICAL]
R184  10k  POTZEPHPOT  [OG-POTS_ALPS_POT_VERTICAL]
R185  10k  POTZEPHPOT  [OG-POTS_ALPS_POT_VERTICAL]
R186  10k  POTZEPHPOT  [OG-POTS_ALPS_POT_VERTICAL]
R199  100k  R-0603  [R0603]

### Nets
5V [power]: R180.P$3(A) R184.P$3(A) ; also sheet 1,2,6
12V [power]: C9.2 C57.2 IC16.11 IC17.11 ; also sheet 1,2,4,6,7
-5V [power]: R178.P$3(A) R181.P$3(A) R182.P$3(A) R183.P$3(A) R185.P$3(A) R186.P$3(A) ; also sheet 1,2,6
-12V [power]: C14.1 C43.1 R168.2 R174.2 ; also sheet 1,2,4,6,7
A2_IN: R167.2 R182.P$2(S)
A_IN: R163.2 R186.P$2(S)
AMPENVELOPEOUT: IC16.2 J13.TIP@3(TIP) R169.2 ; also sheet 1,4
D2_IN: R177.2 R181.P$2(S)
D_IN: R172.2 R185.P$2(S)
GATE_IN: C56.1 C59.1 IC16.4 IC17.4 R199.1 ; also sheet 1
GND [power]: C9.1 C14.2 C43.2 C53.1 C54.1 C55.1 C57.1 C60.1 IC16.7 IC16.14 IC17.7 IC17.14 J11.RING@3(RING) J13.RING@3(RING) R162.2 R166.2 R170.2 R171.1 R175.2 R176.1 R178.P$1(E) R180.P$1(E) R181.P$1(E) R182.P$1(E) R183.P$1(E) R184.P$1(E) R185.P$1(E) R186.P$1(E) R199.2 ; also sheet 1,2,3,4,6,7
MODENVOUT: IC17.2 J11.TIP@3(TIP) R173.2 ; also sheet 1
N$1: IC16.15 R162.1 R163.1
N$2: IC16.12 R171.2 R172.1
N$3: IC16.13 R164.1 R170.1
N$4: C53.2 IC16.1
N$6: C56.2 IC16.5
N$9: IC16.6 R168.1
N$10: C55.2 IC16.8
N$11: IC16.10 R169.1
N$58: IC17.15 R166.1 R167.1
N$59: IC17.12 R176.2 R177.1
N$60: IC17.13 R175.1 R179.1
N$61: C59.2 IC17.5
N$62: IC17.6 R174.1
N$63: C60.2 IC17.8
N$64: IC17.10 R173.1
N$65: C54.2 IC17.1
R2_IN: R178.P$2(S) R179.2
R_IN: R164.2 R183.P$2(S)
S2_IN: IC17.9 R180.P$2(S)
S_IN: IC16.9 R184.P$2(S)
Unconnected: IC16.3 IC16.16 IC17.3 IC17.16 J11.SECOND@3(SECOND) J11.SWITCH@3(SWITCH) J13.SECOND@3(SECOND) J13.SWITCH@3(SWITCH)

### Notes on the sheet
- Envelopes

## Sheet 6 of 7: Filter
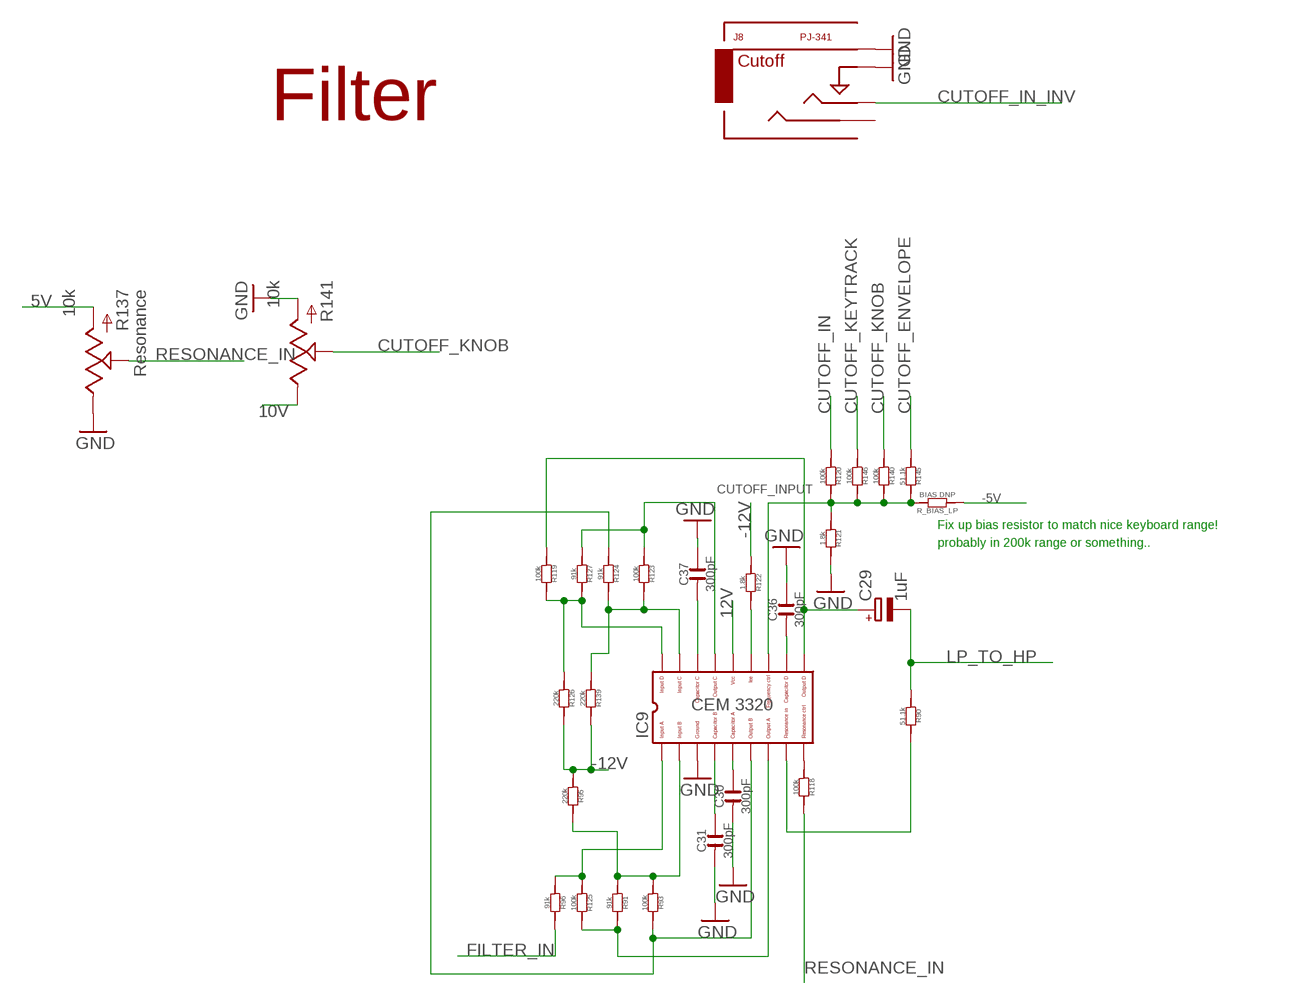
[diagram p7: schematic, sheet 6, part 1 of 2]
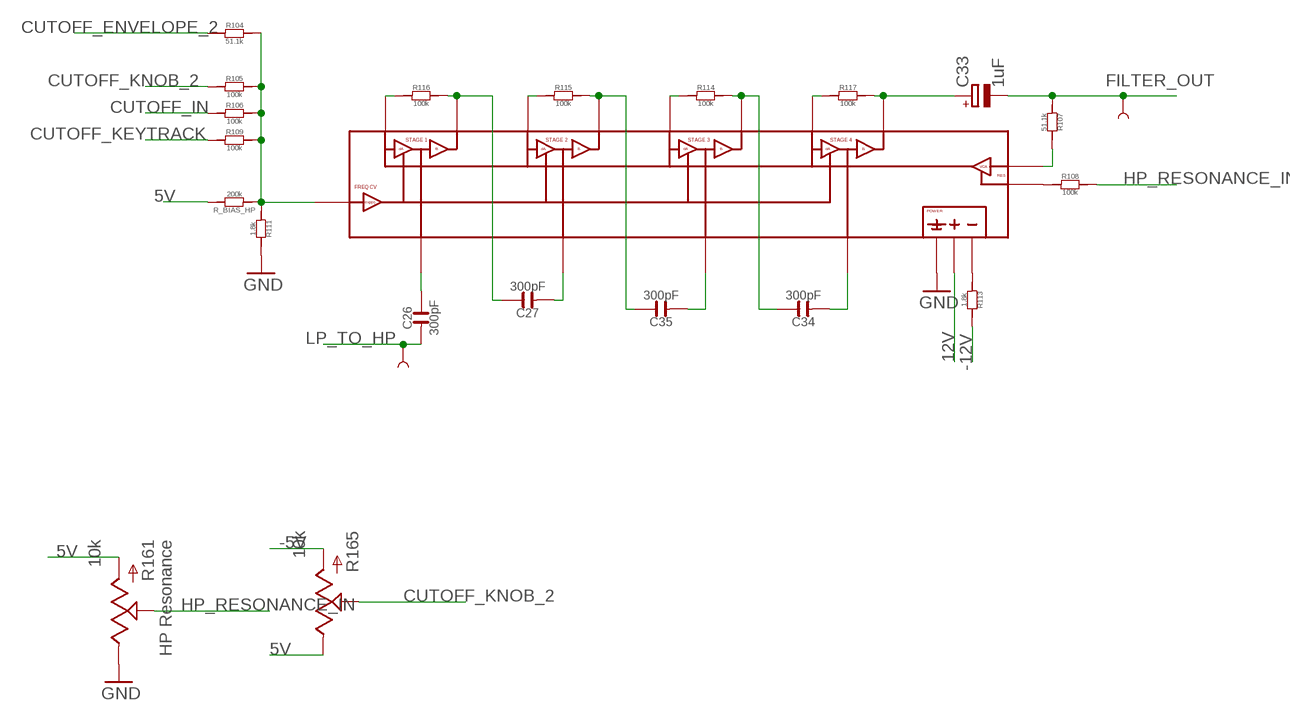
[diagram p8: schematic, sheet 6, part 2 of 2]

### Parts
C26  300pF  C-0603  [C0603]
C27  300pF  C-0603  [C0603]
C29  1uF  CAPACITOR_POL-CASE_B  [CASE_B]
C30  300pF  C-0603  [C0603]
C31  300pF  C-0603  [C0603]
C33  1uF  CAPACITOR_POL-CASE_B  [CASE_B]
C34  300pF  C-0603  [C0603]
C35  300pF  C-0603  [C0603]
C36  300pF  C-0603  [C0603]
C37  300pF  C-0603  [C0603]
IC8  CEM3320_UNFOLDEDQFN  [QFN24]
IC9  CEM3320QFN24  [QFN24]
J8  PJ-341  AUDIO-JACKINPUT  [3.5MM-JACK-SWITCH-13MM-INPUT]
R90  51.1k  R-0603  [R0603]
R91  91k  R-0603  [R0603]
R93  100k  R-0603  [R0603]
R95  220k  R-0603  [R0603]
R96  91k  R-0603  [R0603]
R104  51.1k  R-0603  [R0603]
R105  100k  R-0603  [R0603]
R106  100k  R-0603  [R0603]
R107  51.1k  R-0603  [R0603]
R108  100k  R-0603  [R0603]
R109  100k  R-0603  [R0603]
R111  1.8k  R-0603  [R0603]
R113  1.8k  R-0603  [R0603]
R114  100k  R-0603  [R0603]
R115  100k  R-0603  [R0603]
R116  100k  R-0603  [R0603]
R117  100k  R-0603  [R0603]
R118  100k  R-0603  [R0603]
R119  100k  R-0603  [R0603]
R120  100k  R-0603  [R0603]
R121  1.8k  R-0603  [R0603]
R122  1.8k  R-0603  [R0603]
R123  100k  R-0603  [R0603]
R124  91k  R-0603  [R0603]
R125  100k  R-0603  [R0603]
R126  220k  R-0603  [R0603]
R127  91k  R-0603  [R0603]
R137  10k  POTZEPHPOT  [OG-POTS_ALPS_POT_VERTICAL]
R139  220k  R-0603  [R0603]
R140  100k  R-0603  [R0603]
R141  10k  POTZEPHPOT_BIGKNOB  [OG-POTS_ALPS_POT_VERTICAL_WITHBIGKNOB]
R145  51.1k  R-0603  [R0603]
R146  100k  R-0603  [R0603]
R161  10k  POTZEPHPOT  [OG-POTS_ALPS_POT_VERTICAL]
R165  10k  POTZEPHPOT_BIGKNOB  [OG-POTS_ALPS_POT_VERTICAL_WITHBIGKNOB]
R_BIAS_HP  200k  R-0603  [R0603]
R_BIAS_LP  BIAS DNP  R-0603  [R0603]
TP7  TEST-POINT3X5  [PAD.03X.05]
TP8  TEST-POINT3X5  [PAD.03X.05]

### Nets
5V [power]: R137.P$3(A) R161.P$3(A) R165.P$1(E) R_BIAS_HP.2 ; also sheet 1,2,5
10V [power]: R141.P$1(E) ; also sheet 1,2
12V [power]: IC8.P$22(POSRAIL) IC9.P$22 ; also sheet 1,2,4,5,7
-5V [power]: R165.P$3(A) R_BIAS_LP.1 ; also sheet 1,2,5
-12V [power]: R95.1 R113.2 R122.1 R126.2 R139.2 ; also sheet 1,2,4,5,7
CUTOFF_ENVELOPE: R145.1 ; also sheet 1
CUTOFF_ENVELOPE_2: R104.1 ; also sheet 1
CUTOFF_IN: R106.1 R120.1 ; also sheet 1
CUTOFF_IN_INV: J8.TIP@3(TIP) ; also sheet 1
CUTOFF_INPUT [nearfilter]: IC9.P$19 R120.2 R121.1 R140.2 R145.2 R146.2 R_BIAS_LP.2
CUTOFF_KEYTRACK: R109.1 R146.1 ; also sheet 1
CUTOFF_KNOB: R140.1 R141.P$2(S)
CUTOFF_KNOB_2: R105.1 R165.P$2(S)
FILTER_IN: R96.2 ; also sheet 3,4
FILTER_OUT: C33.- R107.1 TP7.P$1 ; also sheet 4
GND [power]: C30.1 C31.1 C36.2 C37.2 IC8.P$7(GROUND) IC9.P$7 J8.RING@3(RING) J8.SWITCH@3(SWITCH) R111.2 R121.2 R137.P$1(E) R141.P$3(A) R161.P$1(E) ; also sheet 1,2,3,4,5,7
HP_FILTER_CUTOFF_IN [nearfilter]: IC8.P$19(FREQCV) R104.2 R105.2 R106.2 R109.2 R111.1 R_BIAS_HP.1
HP_RESONANCE_IN: R108.2 R161.P$2(S)
LP_TO_HP: C26.1 C29.- R90.1 TP8.P$1
N$17 [nearfilter]: C37.1 IC9.P$24
N$18 [nearfilter]: C31.2 IC9.P$8
N$19 [nearfilter]: C30.2 IC9.P$9
N$20 [nearfilter]: C36.1 IC9.P$17
N$21 [nearfilter]: IC9.P$15 R118.1
N$23 [nearfilter]: IC9.P$4 R96.1 R125.1
N$24 [nearfilter]: IC9.P$12 R91.2 R125.2
N$25 [nearfilter]: IC9.P$11 R93.2 R124.1
N$26: IC9.P$3 R119.2 R126.1 R127.2
N$27 [nearfilter]: IC9.P$2 R123.2 R124.2 R139.1
N$28 [nearfilter]: IC9.P$23 R123.1 R127.1
N$29 [nearfilter]: IC9.P$20 R122.2
N$30 [nearfilter]: C29.+ IC9.P$16 R119.1
N$32 [nearfilter]: IC9.P$14 R90.2
N$33 [nearfilter]: IC9.P$5 R91.1 R93.1 R95.2
N$121 [nearfilter]: IC8.P$20(NEGRAIL) R113.1
N$124 [nearfilter]: IC8.P$15(RESONANCE_CV) R108.1
N$128 [nearfilter]: C26.2 IC8.P$9(STAGE1_CAP)
N$129 [nearfilter]: IC8.P$4(STAGE1_IN) R116.1
N$130 [nearfilter]: C27.2 IC8.P$12(STAGE1_OUT) R116.2
N$131 [nearfilter]: C27.1 IC8.P$8(STAGE2_CAP)
N$132 [nearfilter]: IC8.P$5(STAGE2_IN) R115.1
N$133 [nearfilter]: C35.2 IC8.P$11(STAGE2_OUT) R115.2
N$134 [nearfilter]: C35.1 IC8.P$24(STAGE3_CAP)
N$135 [nearfilter]: IC8.P$2(STAGE3_IN) R114.1
N$136 [nearfilter]: C34.2 IC8.P$23(STAGE3_OUT) R114.2
N$137: C34.1 IC8.P$17(STAGE4_CAP)
N$138 [nearfilter]: IC8.P$3(STAGE4_IN) R117.1
N$139 [nearfilter]: C33.+ IC8.P$16(STAGE4_OUT) R117.2
N$141 [nearfilter]: IC8.P$14(FEEDBACK_IN) R107.2
RESONANCE_IN: R118.2 R137.P$2(S)
Unconnected: J8.SECOND@3(SECOND)

### Notes on the sheet
- Filter
- Fix up bias resistor to match nice keyboard range!
- probably in 200k range or something..

## Sheet 7 of 7: SubOsc
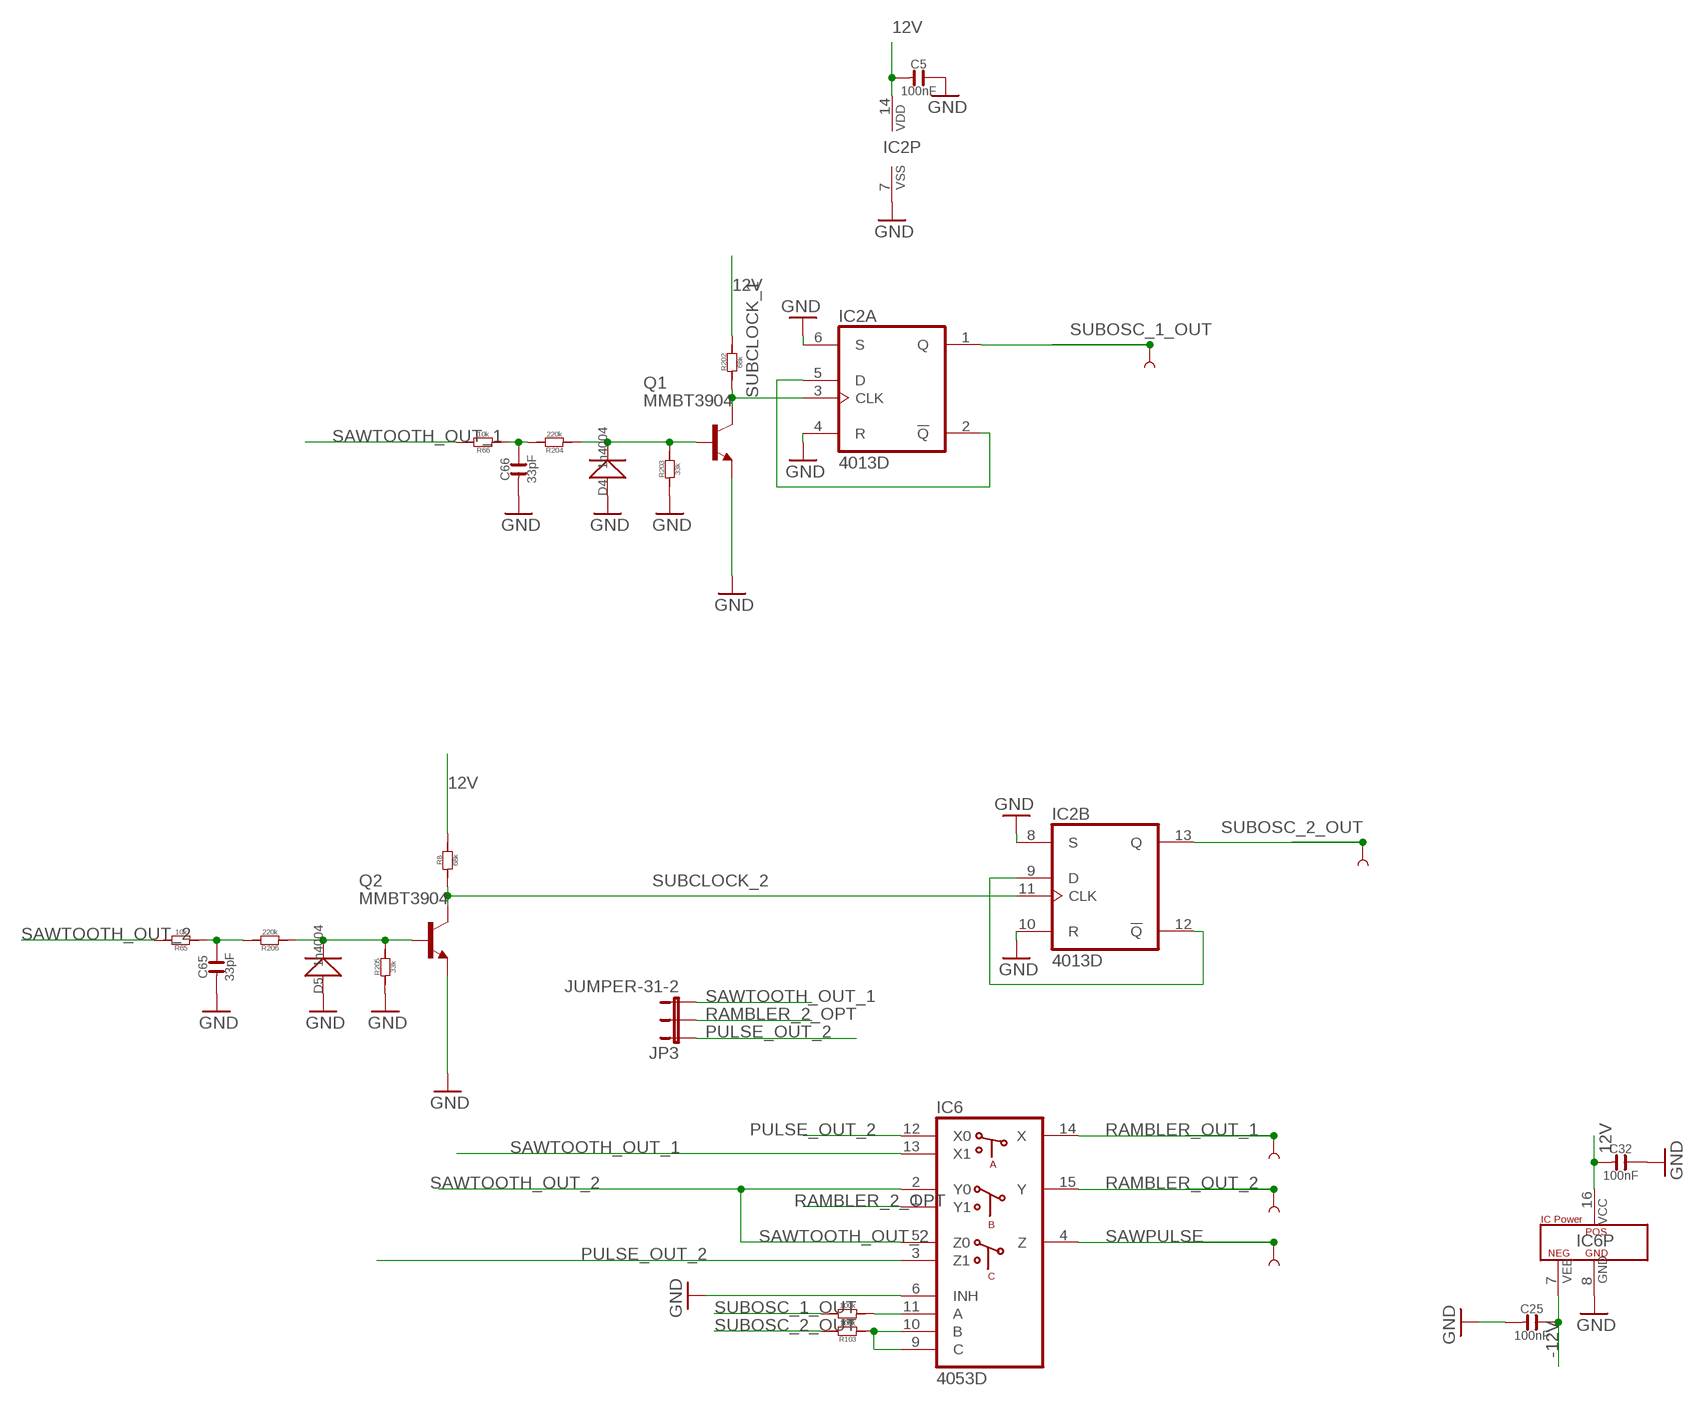
[diagram p9: schematic, sheet 7]

### Parts
C5  100nF  C-0603  [C0603]
C25  100nF  C-0603  [C0603]
C32  100nF  C-0603  [C0603]
C65  33pF  C-0603  [C0603]
C66  33pF  C-0603  [C0603]
D4  1n4004  D-SMA  [DO-214AC]
D5  1n4004  D-SMA  [DO-214AC]
IC2  4013D  [SO14]
IC6  4053D  [SO16]
JP3  JUMPER-31-2  [SJ_3_PASTE1&2]
Q1  MMBT3904  MMBT3904LT1-NPN-SOT23-BEC  [SOT23-BEC]
Q2  MMBT3904  MMBT3904LT1-NPN-SOT23-BEC  [SOT23-BEC]
R8  68k  R-0603  [R0603]
R43  100k  R-0603  [R0603]
R65  10k  R-0603  [R0603]
R66  10k  R-0603  [R0603]
R103  100k  R-0603  [R0603]
R202  68k  R-0603  [R0603]
R203  33k  R-0603  [R0603]
R204  220k  R-0603  [R0603]
R205  33k  R-0603  [R0603]
R206  220k  R-0603  [R0603]
TP1  TEST-POINT3X5  [PAD.03X.05]
TP2  TEST-POINT3X5  [PAD.03X.05]
TP4  TEST-POINT3X5  [PAD.03X.05]
TP5  TEST-POINT3X5  [PAD.03X.05]
TP6  TEST-POINT3X5  [PAD.03X.05]

### Nets
12V [power]: C5.1 C32.1 IC2.14(P:VDD) IC6.16(VCC) R8.2 R202.2 ; also sheet 1,2,4,5,6
-12V [power]: C25.2 IC6.7(VEE) ; also sheet 1,2,4,5,6
GND [power]: C5.2 C25.1 C32.2 C65.1 C66.1 D4.1(+) D5.1(+) IC2.4(A:R) IC2.6(A:S) IC2.7(P:VSS) IC2.8(B:S) IC2.10(B:R) IC6.6(INH) IC6.8(GND) Q1.E Q2.E R203.1 R205.1 ; also sheet 1,2,3,4,5,6
N$70: IC6.9(C) IC6.10(B) R103.1
N$74: D5.2(-) Q2.B R205.2 R206.1
N$102: C65.2 R65.1 R206.2
N$106: IC6.11(A) R43.1
N$107: C66.2 R66.1 R204.2
N$149: D4.2(-) Q1.B R203.2 R204.1
PULSE_OUT_2: IC6.3(Z1) IC6.12(X0) JP3.1 ; also sheet 2,3
RAMBLER_2_OPT [power]: IC6.1(Y1) JP3.2
RAMBLER_OUT_1: IC6.14(X) TP5.P$1 ; also sheet 3
RAMBLER_OUT_2: IC6.15(Y) TP4.P$1 ; also sheet 3
SAWPULSE: IC6.4(Z) TP6.P$1 ; also sheet 3
SAWTOOTH_OUT_1: IC6.13(X1) JP3.3 R66.2 ; also sheet 2,3
SAWTOOTH_OUT_2: IC6.2(Y0) IC6.5(Z0) R65.2 ; also sheet 2,3
SUBCLOCK_1: IC2.3(A:CLK) Q1.C R202.1
SUBCLOCK_2: IC2.11(B:CLK) Q2.C R8.1
SUBOSC1_FEEDBACK: IC2.2(A:!Q) IC2.5(A:D)
SUBOSC2_FEEDBACK: IC2.9(B:D) IC2.12(B:!Q)
SUBOSC_1_OUT: IC2.1(A:Q) R43.2 TP2.P$1 ; also sheet 3
SUBOSC_2_OUT: IC2.13(B:Q) R103.2 TP1.P$1 ; also sheet 3

## Library data of the parts
C1-C10 C12 C14-C19 C21 C23-C28 C30-C32 C34-C48 C50-C63 C65 C66 = OPL:C*
C11 C20 C29 C33 C64 C67-C75 = dp_devices:CAPACITOR_POL: Polarized capacitor in various packages
C49 = OPL:C*; MF: AVX; MPN: 06035C104KAT2A; OC_FARNELL: 1301804
D1-D5 = OPL:D*: DIODE
D6 D7 = adafruit:DIODE: Diode SMADIODE - SMA Surface Mount Package 20V 1A Schottky Diode Digikey: 641-1014-6-ND DO-1N4148 - Through Hole Small Current Diode SOD-123 20V 1 A (.5mV Vf) Schottky Diode - Digikey: MBRX120TPMSCT-ND SOD-323 10V 570mA (.38mV Vf, 3ns) Schottky Diode - Digikey: ZLLS410CT-ND SOD-523 30V 30mA Schottky Diode (RB751S-40TE61) - Digikey: RB751S-40TE61CT-ND SOT23-R/W - SOT23 Package (R = Solder Paste/Reflow Ovens, W = Hand-Soldering) BAT54Film 40V 300mA - Digikey: 497-7162-1-ND
H1-H4 = zephod-components:MOUNT-HOLE: MOUNTING HOLE with drill center marker
IC1 IC7 IC10-IC13 IC15 IC18 = EurorackModularParts:TL072
IC2 = 40xx:4013: Dual D FLIP FLOP, set/reset
IC3 IC4 = CEM:CEM3340: CEM 3340 VCO
IC6 = 40xx:4053: Triple 2-channel ANALOG MULTIPLEXER
IC8 = CEM:CEM3320_UNFOLDED
IC9 = CEM:CEM3320: CEM 3330 VCF
IC14 = CEM:CEM3360
IC16 IC17 = CEM:CEM3310: CEM 3310 VCEG
J1 = EurorackModularParts:AUDIO-JACK: Switching Mono 3.5mm Audio Jack from Erthenvar.; DESC: FM; MPN: PJ-341
J2 = EurorackModularParts:AUDIO-JACK: Switching Mono 3.5mm Audio Jack from Erthenvar.; DESC: Gate; MPN: PJ-341
J3 = EurorackModularParts:AUDIO-JACK: Switching Mono 3.5mm Audio Jack from Erthenvar.; DESC: CV; MPN: PJ-341
J4 = EurorackModularParts:AUDIO-JACK: Switching Mono 3.5mm Audio Jack from Erthenvar.; DESC: Sync; MPN: PJ-341
J5 J6 = EurorackModularParts:AUDIO-JACK: Switching Mono 3.5mm Audio Jack from Erthenvar.; DESC: PWM; MPN: PJ-341
J7 = EurorackModularParts:AUDIO-JACK: Switching Mono 3.5mm Audio Jack from Erthenvar.; DESC: Oscs; MPN: PJ-341
J8 = EurorackModularParts:AUDIO-JACK: Switching Mono 3.5mm Audio Jack from Erthenvar.; DESC: Cutoff; MPN: PJ-341
J9 = EurorackModularParts:AUDIO-JACK: Switching Mono 3.5mm Audio Jack from Erthenvar.; DESC: Input; MPN: PJ-341
J10 = EurorackModularParts:AUDIO-JACK: Switching Mono 3.5mm Audio Jack from Erthenvar.; DESC: Filtered; MPN: PJ-341
J11 = EurorackModularParts:AUDIO-JACK: Switching Mono 3.5mm Audio Jack from Erthenvar.; DESC: MODEnvelope; MPN: PJ-341
J12 = EurorackModularParts:AUDIO-JACK: Switching Mono 3.5mm Audio Jack from Erthenvar.; DESC: Unfiltered; MPN: PJ-341
J13 = EurorackModularParts:AUDIO-JACK: Switching Mono 3.5mm Audio Jack from Erthenvar.; DESC: Envelope; MPN: PJ-341
J14 = EurorackModularParts:POWER
JP1 = SparkFun-Connectors:M03: Header 3 Standard 3-pin 0.1" header. Use with straight break away headers (SKU : PRT-00116), right angle break away headers (PRT-00553), swiss pins (PRT-00743), machine pins (PRT-00117), and female headers (PRT-00115). Molex polarized connector foot print use with SKU : PRT-08232 with associated crimp pins and housings.
JP2 = SparkFun-Connectors:M03X2: 2x3 .1" header. Shrouded, with keying- CONN-10681 SMT- CONN-11415 Pogo pins- HW-11044
JP3 = SparkFun-Passives:JUMPER-3
PCB1 = EurorackModularParts:EURORACK_PCB
Q1 Q2 = transistor:*-NPN-: NPN Transistror BF959 corrected 2008.03.06; MF: NXP; MPN: PMBT3904,215; OC_FARNELL: 2336795
R1 = EurorackModularParts:POT; DESC: FM
R2-R8 R10 R12-R23 R25 R28-R41 R43 R44 R46-R57 R61 R62 R64-R73 R75 R77 R79 R88 R90-R96 R103-R109 R111 R113-R127 R135 R139 R140 R143-R147 R149-R157 R159 R162-R164 R166-R177 R179 R195-R206 R_BIAS_HP R_BIAS_LP = OPL:R*
R9 = EurorackModularParts:POT; DESC: Fine 2
R11 = EurorackModularParts:POT; DESC: Saw 2
R24 = EurorackModularParts:POT; DESC: Saw
R26 = EurorackModularParts:POT; DESC: Fine
R27 = EurorackModularParts:POT; DESC: Coarse 2
R42 = EurorackModularParts:POT; DESC: Coarse
R45 = EurorackModularParts:POT; DESC: Triangle 2
R60 = EurorackModularParts:POT; DESC: Triangle
R63 = EurorackModularParts:POT; DESC: Pulse 2
R74 = EurorackModularParts:POT; DESC: Pulse
R76 R89 = EurorackModularParts:POT; DESC: PWM
R78 = EurorackModularParts:POT; DESC: Sub 2
R87 = EurorackModularParts:POT; DESC: Sub 1
R134 = EurorackModularParts:POT; DESC: Mod->Pitch 2
R136 = EurorackModularParts:POT; DESC: Mod->Cutoff
R137 = EurorackModularParts:POT; DESC: Resonance
R141 = EurorackModularParts:POT; DESC: Cutoff
R142 = EurorackModularParts:POT; DESC: Mod->Pitch
R148 = OPL:R*; OC_FARNELL: unknown
R158 = EurorackModularParts:POT; DESC: Keytrack
R160 = EurorackModularParts:POT; DESC: Mod->HP Cutoff
R161 = EurorackModularParts:POT; DESC: HP Resonance
R165 = EurorackModularParts:POT; DESC: HP Cutoff
R178 R183 = EurorackModularParts:POT; DESC: R
R180 R184 = EurorackModularParts:POT; DESC: S
R181 R185 = EurorackModularParts:POT; DESC: D
R182 R186 = EurorackModularParts:POT; DESC: A
R187 = EurorackModularParts:TRIMPOT; DESC: Osc2: Scale
R188 = EurorackModularParts:TRIMPOT; DESC: Osc1: Hi
R189 = EurorackModularParts:TRIMPOT; DESC: Osc2: Hi
R190 = EurorackModularParts:TRIMPOT; DESC: Osc1: Scale
R191 = EurorackModularParts:TRIMPOT; DESC: Osc2 PitchMod
R192 = EurorackModularParts:TRIMPOT; DESC: LP Cutoff Mod
R193 = EurorackModularParts:TRIMPOT; DESC: Osc1 PitchMod
R194 = EurorackModularParts:TRIMPOT; DESC: HP Cutoff Mod
S1 S3 = EurorackModularParts:ONOFFON
S2 = zephod-components:SWITCH_W_LED_PB6149L-X-102
TP1 = SparkFun-Passives:TEST-POINT: Bare copper test points for troubleshooting or ICT; DESC: SubOsc 2
TP2 = SparkFun-Passives:TEST-POINT: Bare copper test points for troubleshooting or ICT; DESC: SubOsc 1
TP3 = SparkFun-Passives:TEST-POINT: Bare copper test points for troubleshooting or ICT; DESC: Osc1: SoftSync
TP4 = SparkFun-Passives:TEST-POINT: Bare copper test points for troubleshooting or ICT; DESC: Rambler 2
TP5 = SparkFun-Passives:TEST-POINT: Bare copper test points for troubleshooting or ICT; DESC: Rambler 1
TP6 = SparkFun-Passives:TEST-POINT: Bare copper test points for troubleshooting or ICT; DESC: SawPulse
TP7 = SparkFun-Passives:TEST-POINT: Bare copper test points for troubleshooting or ICT; DESC: Filter Out
TP8 = SparkFun-Passives:TEST-POINT: Bare copper test points for troubleshooting or ICT; DESC: LP -> HP
U1 = FarnellThings:LM4040DIM3-5.0: IC, Precision Micropower Shunt Voltage Reference, 5V,SOT-23-3; MF: TEXAS INSTRUMENTS; MPN: LM4040DIM3-5.0; OC_FARNELL: 9778330; OC_NEWARK: 97K3489; PACKAGE: SOT-23-3; SUPPLIER: TEXAS INSTRUMENTS

## Net classes
0 default: width 0.305 mm
1 power: width 0.508 mm
2 nearfilter: width 0.254 mm
3 groundplane: width 0.203 mm, clearance 0.203 mm